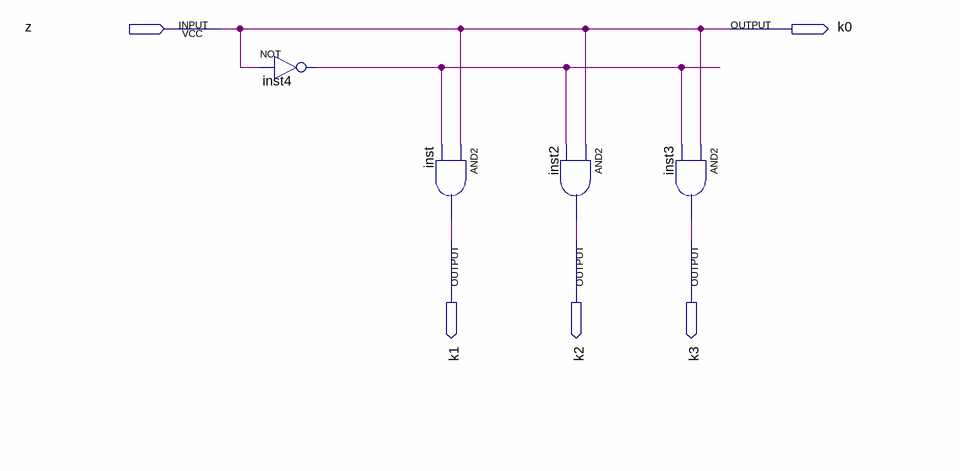
[diagram p0: schematic sheet]
// Quartus schematic koloA2.bdf as structural Verilog: 4 symbols, 5 pins
module koloA2 (
  input  z,
  output k0,
  output k1,
  output k2,
  output k3
);

  wire inst4_out;

  not inst4 (inst4_out, z);
  and inst (k1, z, inst4_out);
  and inst2 (k2, z, inst4_out);
  and inst3 (k3, z, inst4_out);

  assign k0 = z;
endmodule
